# Altium project ESP32_CAN.PrjPcb
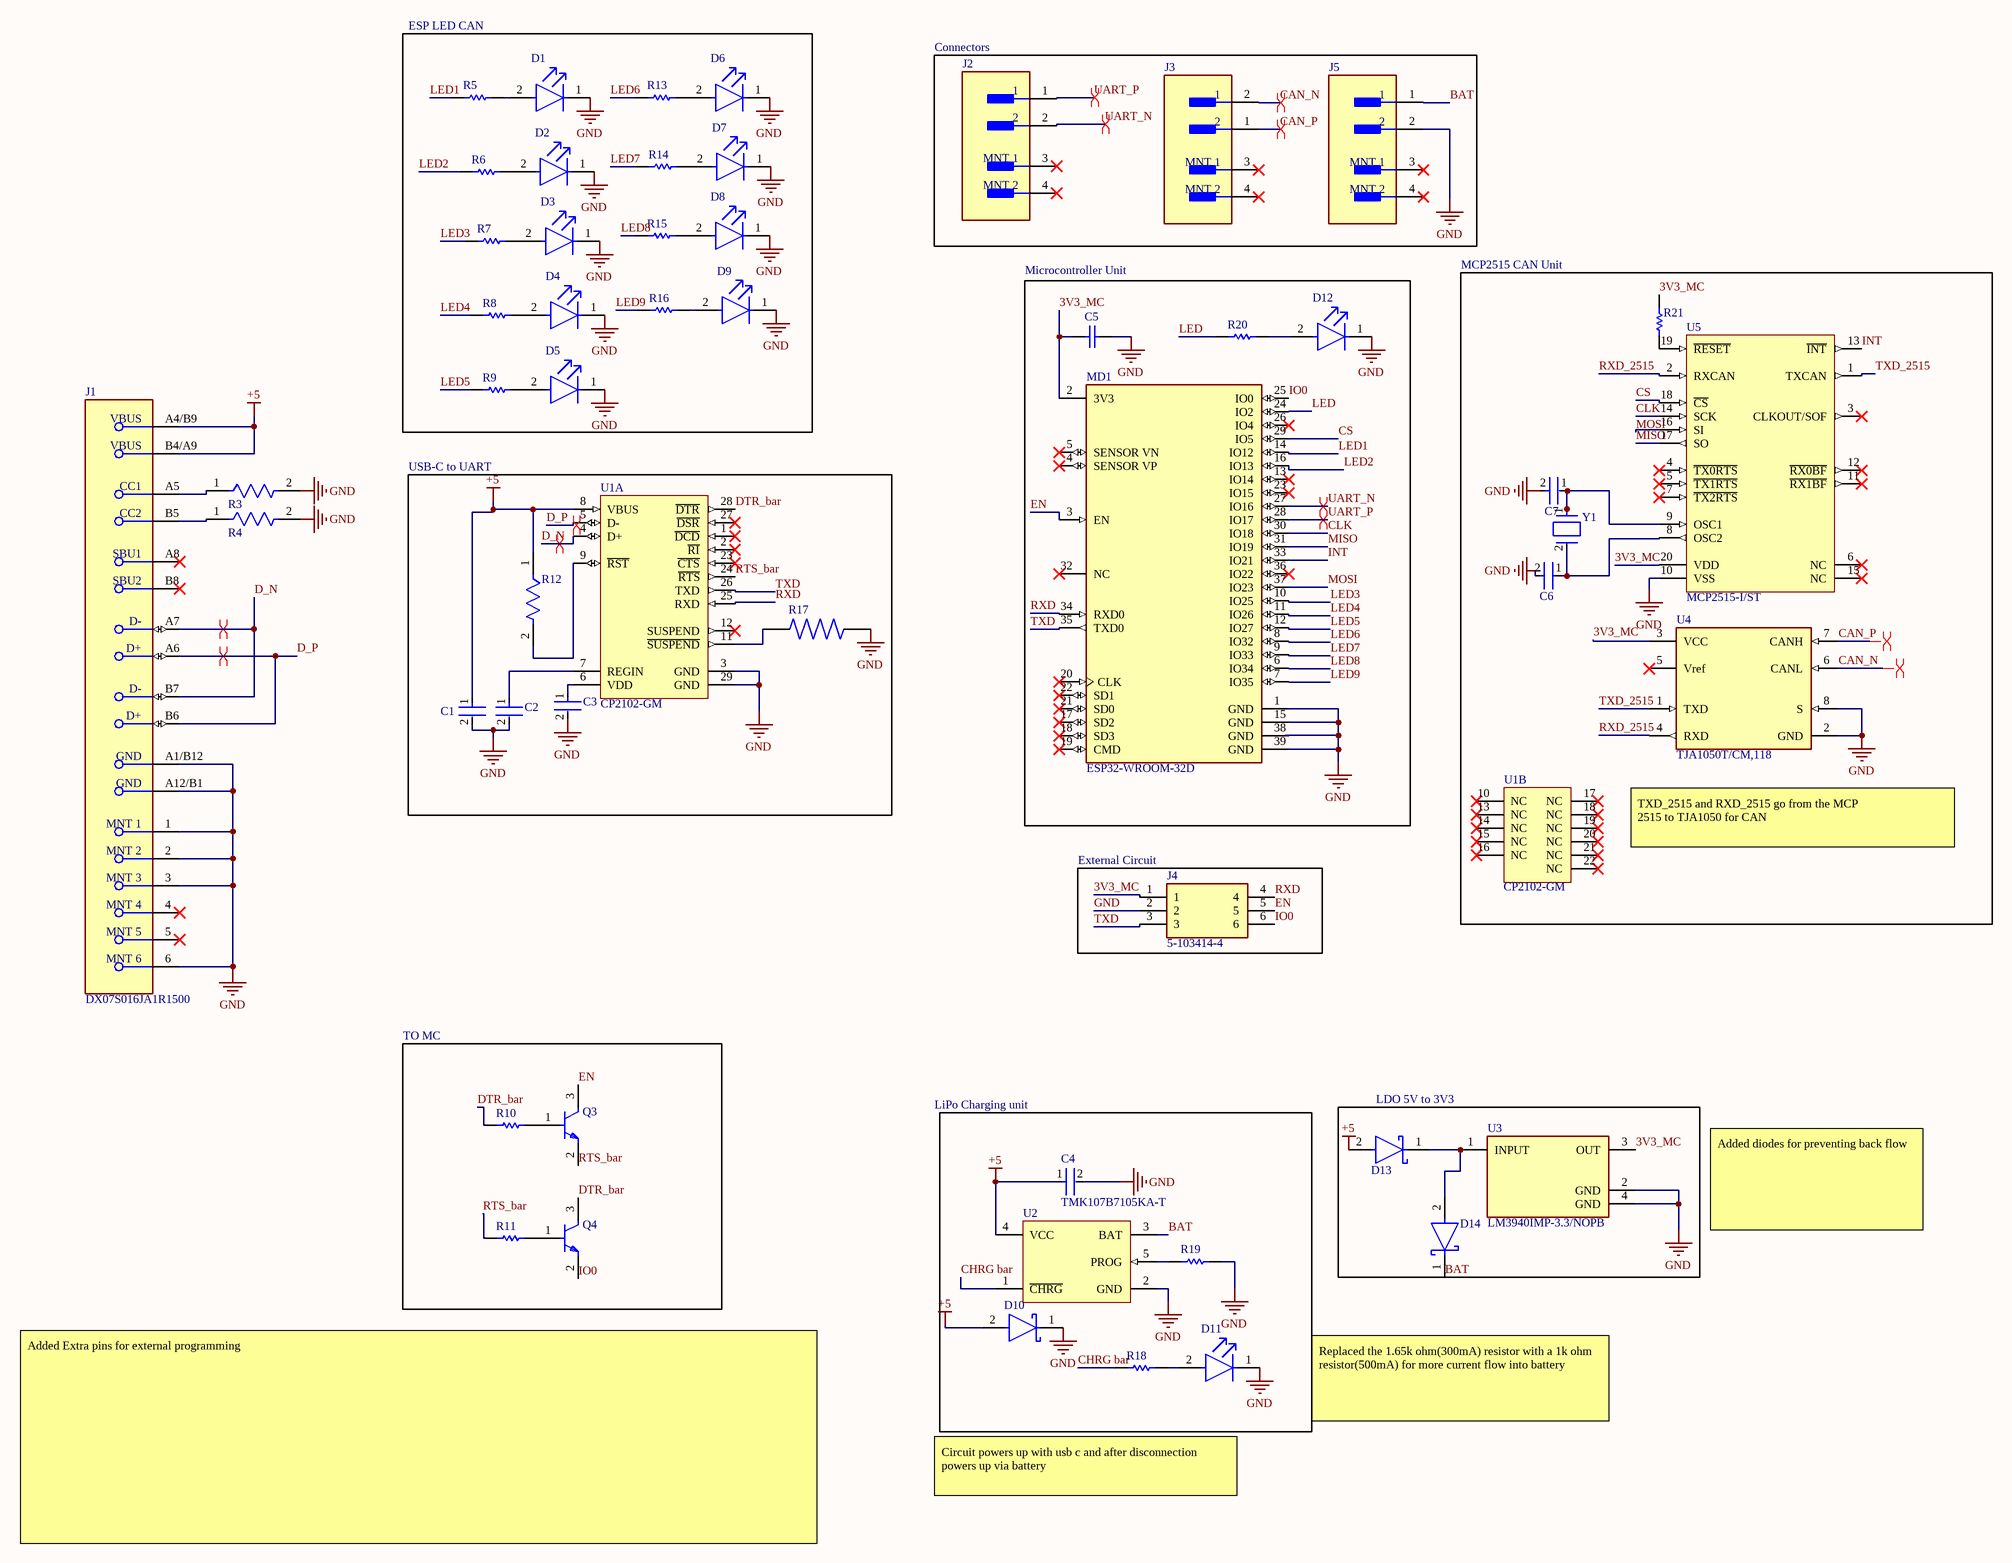
[diagram p0: ESP32_CAN.SchDoc]
1 sheet, 54 parts. Net scope: global (net labels, ports and power ports of the same name join across sheets).
Board file: ESP32_CAN.PcbDoc

## Sheet ESP32_CAN.SchDoc
size A2; SheetNumber: 1; SheetTotal: 1

### Parts
C1  TMK107B7105KA-T  [FP-0603-L_1_6_0_1-W_0_8_0-MFG]  (value not drawn)
C2  C0603C104K5RACTU  [FP-C0603C-CF-MFG]  (value not drawn)
C3  GRM033R60J104KE19D  [FP-GRM033-0_03-MFG]  (value not drawn)
C4  TMK107B7105KA-T  [FP-0603-L_1_6_0_1-W_0_8_0-MFG]
C5  GRM188R71H104KA93D  [CAPC1608X90X35ML10T15]  (value not drawn)
C6  C1608C0G1H220J080AA  [FP-C1608-080-0_1-MFG]  (value not drawn)
C7  C1608C0G1H220J080AA  [FP-C1608-080-0_1-MFG]  (value not drawn)
D1  LTST-C191TBKT  [FP-LTST-C191TBKT-MFG]  (value not drawn)
D2  LTST-C191TBKT  [FP-LTST-C191TBKT-MFG]  (value not drawn)
D3  LTST-C191TBKT  [FP-LTST-C191TBKT-MFG]  (value not drawn)
D4  LTST-C191TBKT  [FP-LTST-C191TBKT-MFG]  (value not drawn)
D5  LTST-C191TBKT  [FP-LTST-C191TBKT-MFG]  (value not drawn)
D6  LTST-C191TBKT  [FP-LTST-C191TBKT-MFG]  (value not drawn)
D7  LTST-C191TBKT  [FP-LTST-C191TBKT-MFG]  (value not drawn)
D8  LTST-C191TBKT  [FP-LTST-C191TBKT-MFG]  (value not drawn)
D9  LTST-C191TBKT  [FP-LTST-C191TBKT-MFG]  (value not drawn)
D10  DFLS1200Q-7  [FP-PowerDI123-MFG]  (value not drawn)
D11  LTST-C191TBKT  [FP-LTST-C191TBKT-MFG]  (value not drawn)
D12  LTST-C191TBKT  [FP-LTST-C191TBKT-MFG]  (value not drawn)
D13  1N5819HW-7-F  [FP-SOD123-MFG]  (value not drawn)
D14  1N5819HW-7-F  [FP-SOD123-MFG]  (value not drawn)
J1  DX07S016JA1R1500  [FP-DX07S016JA1R1500-MFG]
J2  BM02B-GHS-TBT(LF)(SN)(N)  [FP-BM02B-GHS-TBT_LF_SN-MFG]  (value not drawn)
J3  BM02B-GHS-TBT(LF)(SN)(N)  [FP-BM02B-GHS-TBT_LF_SN-MFG]  (value not drawn)
J4  5-103414-4  [TE_5-103414-4]
J5  BM02B-GHS-TBT(LF)(SN)(N)  [FP-BM02B-GHS-TBT_LF_SN-MFG]  (value not drawn)
MD1  ESP32-WROOM-32D  [FP-ESP32-WROOM-32D-MFG]
Q3  BC817-25,215  [FP-SOT23-MFG]  (value not drawn)
Q4  BC817-25,215  [FP-SOT23-MFG]  (value not drawn)
R3  ERJ-3EKF5101V  [FP-ERJ3EK-MFG]  (value not drawn)
R4  ERJ-3EKF5101V  [FP-ERJ3EK-MFG]  (value not drawn)
R5  ERJ-3EKF2200V  [RESC1608X55X30LL15T15]  (value not drawn)
R6  ERJ-3EKF2200V  [RESC1608X55X30LL15T15]  (value not drawn)
R7  ERJ-3EKF2200V  [RESC1608X55X30LL15T15]  (value not drawn)
R8  ERJ-3EKF2200V  [RESC1608X55X30LL15T15]  (value not drawn)
R9  ERJ-3EKF2200V  [RESC1608X55X30LL15T15]  (value not drawn)
R10  CRCW040210K0FKEDHP  [RESC1005X40X25ML05T10]  (value not drawn)
R11  CRCW040210K0FKEDHP  [RESC1005X40X25ML05T10]  (value not drawn)
R12  CRCW06034K70FKEA  [FP-CRCW0603-e3-MFG]  (value not drawn)
R13  ERJ-3EKF2200V  [RESC1608X55X30LL15T15]  (value not drawn)
R14  ERJ-3EKF2200V  [RESC1608X55X30LL15T15]  (value not drawn)
R15  ERJ-3EKF2200V  [RESC1608X55X30LL15T15]  (value not drawn)
R16  ERJ-3EKF2200V  [RESC1608X55X30LL15T15]  (value not drawn)
R17  CR0603AFX-1002EAS  [RESC1608X55N]  (value not drawn)
R18  ERJ-3EKF2200V  [RESC1608X55X30LL15T15]  (value not drawn)
R19  RK73H1JTTD1001F  [RESC1608X55X30LL20T10]  (value not drawn)
R20  ERJ-3EKF2200V  [RESC1608X55X30LL15T15]  (value not drawn)
R21  CRCW060310K0FKEA  [RESC1609X50X30NL8T20]  (value not drawn)
U1  CP2102-GM  [SLAB-QFN-28-3125x3125TP_M]  (parts A,B of 2)
U2  LTC4054ES5-4.2#TRMPBF  [LT-S5-5-TSOT-23_M]  (value not drawn)
U3  LM3940IMP-3.3/NOPB  [FP-DCY0004A-MFG]
U4  TJA1050T/CM,118  [FP-SOT96-1-IPC_A]
U5  MCP2515-I/ST  [TSSOP-ST20_N]
Y1  ABM3-8.000MHZ-D2Y-T  [FP-ABM3-MFG]  (value not drawn)

### Blocks framed on the sheet
ESP LED CAN: D1-D9 R5-R9 R13-R16
Connectors: J2 J3 J5
Microcontroller Unit: C5 D12 MD1 R20
MCP2515 CAN Unit: C6 C7 R21 U1 U4 U5 Y1
USB-C to UART: C1-C3 R12 R17 U1
External Circuit: J4
TO MC: Q3 Q4 R10 R11
LDO 5V to 3V3: D13 D14 U3

### Nets
+5: C1.1 C4.1 D10.2(A) D13.2(A) J1.A4/B9(VBUS) J1.B4/A9(VBUS) R12.1 U1.8(VBUS) U2.4(VCC)
GND: C1.2 C2.2 C3.2 C4.2 C5.2 C6.2 C7.2 D1.1(C) D2.1(C) D3.1(C) D4.1(C) D5.1(C) D6.1(C) D7.1(C) D8.1(C) D9.1(C) D10.1(C) D11.1(C) D12.1(C) J1.1(MNT_1) J1.2(MNT_2) J1.3(MNT_3) J1.6(MNT_6) J1.A1/B12(GND) J1.A12/B1(GND) J4.2 J5.2 MD1.1(GND) MD1.15(GND) MD1.39(GND) R3.2 R4.2 R17.2 R19.2 U1.3(GND) U1.29(GND) U2.2(GND) U3.2(GND) U3.4(GND) U4.2(GND) U4.8(S) U5.10(VSS)
3V3_MC: C5.1 J4.1 MD1.2(3V3) R21.2 U3.3(OUT) U4.3(VCC) U5.20(VDD)
BAT: D14.1(C) J5.1 U2.3(BAT)
CAN_N: J3.2 U4.6(CANL)
CAN_P: J3.1 U4.7(CANH)
CHRG bar: R18.1 U2.1(~{CHRG})
CLK: MD1.30(IO18) U5.14(SCK)
CS: MD1.29(IO5) U5.18(~{CS})
D_N: J1.A7(D-) J1.B7(D-) U1.4(D+)
D_P: J1.A6(D+) J1.B6(D+) U1.5(D-)
DTR_bar: Q4.3(C) R10.1 U1.28(~{DTR})
EN: J4.5 MD1.3(EN) Q3.3(C)
INT: MD1.33(IO21) U5.13(~{INT})
IO0: J4.6 MD1.25(IO0) Q4.2(E)
LED: MD1.24(IO2) R20.1
LED1: MD1.14(IO12) R5.1
LED2: MD1.16(IO13) R6.1
LED3: MD1.10(IO25) R7.1
LED4: MD1.11(IO26) R8.1
LED5: MD1.12(IO27) R9.1
LED6: MD1.8(IO32) R13.1
LED7: MD1.9(IO33) R14.1
LED8: MD1.6(IO34) R15.1
LED9: MD1.7(IO35) R16.1
MISO: MD1.31(IO19) U5.17(SO)
MOSI: MD1.37(IO23) U5.16(SI)
RTS_bar: Q3.2(E) R11.1 U1.24(~{RTS})
RXD: J4.4 MD1.34(RXD0) U1.25(RXD)
RXD_2515: U4.4(RXD) U5.2(RXCAN)
TXD: J4.3 MD1.35(TXD0) U1.26(TXD)
TXD_2515: U4.1(TXD) U5.1(TXCAN)
UART_N: J2.2 MD1.27(IO16)
UART_P: J2.1 MD1.28(IO17)
NetC2_1: C2.1 U1.7(REGIN)
NetC3_1: C3.1 U1.6(VDD)
NetC6_1: C6.1 U5.8(OSC2) Y1.2
NetC7_1: C7.1 U5.9(OSC1) Y1.1
NetD1_2: D1.2(A) R5.2
NetD2_2: D2.2(A) R6.2
NetD3_2: D3.2(A) R7.2
NetD4_2: D4.2(A) R8.2
NetD5_2: D5.2(A) R9.2
NetD6_2: D6.2(A) R13.2
NetD7_2: D7.2(A) R14.2
NetD8_2: D8.2(A) R15.2
NetD9_2: D9.2(A) R16.2
NetD11_2: D11.2(A) R18.2
NetD12_2: D12.2(A) R20.2
NetD13_1: D13.1(C) D14.2(A) U3.1(INPUT)
NetJ1_A5: J1.A5(CC1) R3.1
NetJ1_B5: J1.B5(CC2) R4.1
NetQ3_1: Q3.1(B) R10.2
NetQ4_1: Q4.1(B) R11.2
NetR12_2: R12.2 U1.9(~{RST})
NetR17_1: R17.1 U1.11(~{SUSPEND})
NetR19_1: R19.1 U2.5(PROG)
NetR21_1: R21.1 U5.19(~{RESET})

Not connected (* = marked no-connect by the designer): J1 4(MNT_4)* 5(MNT_5)* A8(SBU1)* B8(SBU2)*; J2 3(MNT_1)* 4(MNT_2)*; J3 3(MNT_1)* 4(MNT_2)*; J5 3(MNT_1)* 4(MNT_2)*; MD1 4(SENSOR_VP)* 5(SENSOR_VN)* 13(IO14)* 17(SD2)* 18(SD3)* 19(CMD)* 20(CLK)* 21(SD0)* 22(SD1)* 23(IO15)* 26(IO4)* 32(NC)* 36(IO22)* 38(GND); U1 1(~{DCD})* 2(~{RI})* 10(NC)* 12(SUSPEND)* 13(NC)* 14(NC)* 15(NC)* 16(NC)* 17(NC)* 18(NC)* 19(NC)* 20(NC)* 21(NC)* 22(NC)* 23(~{CTS})* 27(~{DSR})*; U4 5(Vref); U5 3(CLKOUT/SOF)* 4(~{TX0RTS})* 5(~{TX1RTS})* 6(NC)* 7(~{TX2RTS})* 11(~{RX1BF})* 12(~{RX0BF})* 15(NC)*

### Layout directives
differential pair: CAN_N, CAN_P, D_N, D_P, UART_N, UART_P

### Notes on the sheet
- TXD_2515 and RXD_2515 go from the MCP
  2515 to TJA1050 for CAN
- LiPo Charging unit
- Added diodes for preventing back flow
- Replaced the 1.65k ohm(300mA) resistor with a 1k ohm resistor(500mA) for more current flow into battery
- Circuit powers up with usb c and after disconnection powers up via battery
- Added Extra pins for external programming

### Library data of the parts
C1 C4 = CMP-2000-07259-3: None; Voltage Rating (DC): 25V; Dielectric: X7R; Capacitance: 1uF; Tolerance: 10%; Height: 0.8mm; Case Code (Metric): 1608; Max Operating Temperature: 125°C; Case Code (Imperial): 0603; Case/Package: 0603; Resistor Type: Ceramic; Halogen Free: Halogen Free; Series: M; Voltage Rating: 25V; Number of Pins: 2; Depth: 0.8mm; RoHS Compliant: Yes; Mount: Surface Mount; Min Operating Temperature: -55°C; Length: 1.6mm; Contact Plating: Tin; Radiation Hardening: No; Width: 0.031inch; Construction: Flat; Thickness: 0.035inch; Packaging: Tape and Reel; Termination: SMD/SMT; REACH SVHC: No SVHC; Package Quantity: 1
C2 = CMP-2006-03061-2: CAP CER 0.1UF 50V X7R 0603; Manufacturer: KEMET; Tolerance: 0.1; Temperature Coefficient: 30ppm/°C; Material: Ceramic; Automotive Grade: Grade 1; Value: 0.10 μF; Temperature: -55°C to +125°C; RoHS: TRUE; Temperature Range High: +125°C; Lead Free: Yes; Octopart: https://octopart.com/c0603c104k5ractu-kemet-139244; Digikey Description: CAP CER 0.1UF 50V X7R 0603; Category: Cap; Package: C0603C-CF; ComponentLink2Description: Datasheet; Temperature Range Low: -55°C; Device Class L1: Passive Components; Voltage Rating: 50 V; Automotive: Yes; Device Class L3: Ceramic Capacitors; ComponentLink2URL: https://api.kemet.com/component-edge/download/datasheet/C0603C100J5GACAUTO.pdf; Capacitance: 0.10 μF; Device Class L2: Capacitors; Manufacturer Part Number: C0603C104K5RACTU; Temperature Characteristic: X7R; Height: 0.87mm
C3 = CMP-06035-000062-2: Chip Multilayer Ceramic Capacitors for General Purpose, 0201, 0.10uF, X5R, 15%, 10%, 6.3V; Capacitance: 100nF; Min Operating Temperature: -55°C; Lead Free: Lead Free; Radiation Hardening: No; Dielectric: X5R; Voltage Rating (DC): 6.3V; REACH SVHC: No SVHC; Case/Package: 0201; Voltage Rating: 6.3V; Length: 0.6mm; Max Operating Temperature: 85°C; Width: 0.012inch; Depth: 0.3mm; Material: Ceramic; Case Code (Metric): 0603; Thickness: 0.013inch; Packaging: Tape and Reel; Height: 0.3mm; Weight: 6E-06oz; Package Quantity: 1; Mount: Surface Mount; Voltage: 6.3V; Case Code (Imperial): 0201; Tolerance: 10%; Termination: SMD/SMT
C5 = CMP-2100-03643-1: Chip Capacitor, 0.1 uF, +/- 10%, 50 V, -55 to 125 degC, 0603 (1608 Metric), RoHS, Tape and Reel; Manufacturer: Murata; Dielectric Material: Ceramic; Voltage Rating: 50V; Capacitance: 100nF; Dielectric: X7R; Insulation Resistance: 10GR; Case Code (Metric): 1608; Lead Free: LeadFree; Depth: 0.8mm; Number of Pins: 2; Radiation Hardening: No; Case/Package: 0603; Manufacturer URL: http://www.murata.com/; Packaging: TapeandReel; Length: 1.6mm; Contact Plating: Tin; Datasheet URL: http://psearch.en.murata.com/capacitor/product/GRM188R71H104KA93%23.pdf; Tolerance: 10%; Case Code (Imperial): 0603; Min Operating Temperature: -55degC; RoHSCompliant: true; Voltage: 50V; Termination: SMD/SMT; Mount: SurfaceMount; Material: Ceramic; Package Quantity: 1; Height: 0.8mm; Thickness: 0.035inch; REACH SVHC: NoSVHC; Max Operating Temperature: 125degC; Width: 0.8mm; Package Reference: 0603; Voltage Rating (DC): 50V; Datasheet Version: 42675.0; Package Description: 2-Pin Surface Mount Device, Body 1.6 x 0.8 mm
C6 C7 = CMP-2000-06024-2: CAP CER 22PF 50V C0G 0603; Tolerance: 5%; Temperature Coefficient: 30ppm/°C; Dielectric Material: Ceramic; Packaging: Tape and Reel; Termination: SMD/SMT; Case Code (Imperial): 0603; Height: 0.8mm; Capacitance: 22pF; Voltage: 50V; RoHS Compliant: Yes; Voltage Rating: 50V; Depth: 0.8mm; Case Code (Metric): 1608; Voltage Rating (DC): 50V; Construction: Flat; Max Operating Temperature: 125°C; Radiation Hardening: No; Lead Free: Lead Free; Number of Pins: 2; Case/Package: 0603; Thickness: 0.037inch; Min Operating Temperature: -55°C; Width: 0.031inch; Mount: Surface Mount; Weight: 7.1E-05oz; Series: C; Dielectric: C0G; Package Quantity: 1; Length: 1.6mm
D1-D9 D11 D12 = CMP-22017-000008-1: LED BLUE CLEAR CHIP SMD; Lens Color: Colorless; Dominant Wavelength: 475nm; Forward Current: 20mA; Wavelength: 468nm; Viewing Angle: 130°; Power Dissipation: 76mW; Luminous Intensity: 180mcd; Reverse Voltage: 5V; Number of Elements: 1; Lens Style: Diffused; Forward Voltage: 3.8V; Max Power Dissipation: 75mW; Case Code (Metric): 1608; Packaging: Tape and Reel; Case/Package: 0603; Depth: 1.6mm; Mount: Surface Mount; Lead Free: Lead Free; Min Operating Temperature: -20°C; Lens Transparency: Clear; Illumination Color: Blue; Height: 0.55mm; Test Current: 20mA; Case Code (Imperial): 0603; Max Operating Temperature: 80°C; Number of Pins: 2; Length: 0.8mm; Radiation Hardening: No; Package Quantity: 1; Number of LEDs: 1; Width: 0.8mm; Color: Blue
D10 = CMP-12790-000008-1: DIODE SCHOTTKY 200V POWERDI123; Manufacturer: Diodes; Max Surge Forward Current: 40A; Max Junction Temp: +150°C; Forward Current: 1A; Automotive Grade: Grade 0; Peak Reverse Current: 2uA; Value: 23pF; Max Repetitive Reverse Voltage: 200V; ComponentLink2Description: Datasheet; Mouser Description: DFLS1200Q Series 200 V 1 A High Voltage Schottky Barrier Rectifier - POWERDI®123; RoHS: TRUE; Octopart: https://octopart.com/dfls1200q-7-diodes+inc.-46962012; Temperature Range Low: -55°C; Category: Diode; ComponentLink2URL: https://www.diodes.com/assets/Datasheets/DFLS1200Q.pdf; Reverse Voltage: 200V; Temperature Range High: +150°C; Manufacturer Part Number: DFLS1200Q-7; Footprint Url: https://www.diodes.com/assets/Package-Files/PowerDI123.pdf; Automotive: Yes; Height: 1mm; Capacitance: 23pF; Device Class L1: Discrete Semiconductors; Digikey Description: DIODE SCHOTTKY 200V POWERDI123; Lead Free: Yes; Temperature: -55°C to +150°C; Device Class L2: Diodes; Device Class L3: Schottky Diodes; Package: PowerDI123
D13 D14 = CMP-0303-00003-3: DIODE SCHOTTKY 40V 1A SOD123; Forward Voltage: 450mV; Capacitance: 110pF; Max Forward Surge Current (Ifsm): 25A; Peak Reverse Current: 50uA; Polarity: Standard; Element Configuration: Single; Max Power Dissipation: 450mW; Min Operating Temperature: -65°C; Package Quantity: 3000; Contact Plating: Tin; Weight: 0.000353oz; Max Repetitive Reverse Voltage (Vrrm): 40V; Max Reverse Voltage (DC): 40V; Height: 1.25mm; Average Rectified Current: 1A; Width: 1.7mm; Case/Package: SOD-123-2; Lead Free: Lead Free; Max Operating Temperature: 125°C; Current Rating: 1A; Termination: SMD/SMT; Forward Current: 1A; Radiation Hardening: No; Number of Pins: 2; Length: 2.85mm; Voltage Rating (DC): 40V; REACH SVHC: No SVHC; Peak Non-Repetitive Surge Current: 25A; Packaging: Tape and Reel; Output Current: 1A
J1 = CMP-00000-1: USB Connector, 16 Contact(s), Female, Right Angle, Surface Mount Terminal, Locking, Receptacle; Shielding: Shielded; Current Rating: 5A; Number of Ports: 1; Mating Cycles: 10000; USB Standard: USB 2.0; Voltage Rating: 20V; Number of Contacts: 16; Contact Plating: Gold; Termination: Solder; Gender: Receptacle; Series: DX07; Max Operating Temperature: 85°C; Insulation Color: Black; Height: 3.31mm; Min Operating Temperature: -40°C; Connector Type: USB; Mounting Technology: Surface Mount,Through Hole,Horizontal; Contact Material: Nickel,Gold
J2 J3 J5 = CMP-2000-05957-2: CONN HEADER SMD 2POS 1.25MM; Pitch: 0.049inch; Connector Type: Outer Shroud Contact; Number of Positions: 2; Packaging: Tape and Reel; Lead Free: Lead Free; Termination: Solder; Fastening Type: Ramp; Number of Rows: 1; Color: Natural; Contact Plating: Tin; Mount: Surface Mount
J4 = 5-103414-4: 06 MODII HDR SRST SHRD LF; MF: {'manufacturer': u'TE Connectivity'}; Package: None; Price: None; Value: *; MP: 5-103414-4; Availability: Unavailable
MD1 = CMP-194065-000003-1: WIFI MODULE 32MBITS SPI FLASH; Manufacturer: Espressif Systems; Max Supply Voltage: 3.6V; Nominal Supply Current: 500mA; Max Frequency: 2484MHz; Number Of Adc Channels: 16; Number Of Gpio: 32; Interface: I2C,SPI,UART,Ethernet,I2S,Other; Data Rate: 150Mbits/s; Min Supply Voltage: 3V; Bandwidth: 72MHz; Sensitivity: -98dBm; Octopart: https://octopart.com/esp32-wroom-32d-espressif+systems-91040050; Package: ESP32-WROOM-32D; ComponentLink2URL: https://www.espressif.com/sites/default/files/documentation/esp32-wroom-32d_esp32-wroom-32u_datasheet_en.pdf; Lead Free: Yes; Category: UNK; Mouser Description: Wi-Fi/BT BLE Module ESP32-D0WD, SPI Flash, UART, P; Device Class L1: Integrated Circuits (ICs); RoHS: TRUE; Temperature Range Low: -40°C; ComponentLink2Description: Datasheet; Digikey Description: WIFI MODULE 32MBITS SPI FLASH; Height: 3.2mm; Temperature: -40°C to +85°C; Manufacturer Part Number: ESP32-WROOM-32D; Device Class L3: Transceivers; Device Class L2: RF Semiconductors and Devices; Temperature Range High: +85°C; Automotive: No
Q3 Q4 = CMP-14406-000029-1: TRANS NPN 45V 500MA TO236AB; RoHS Compliant: Yes
R3 R4 = CMP-2000-00540-8: RES SMD 5.1K OHM 1% 1/10W 0603; Power Rating: 100mW; Temperature Coefficient: 100ppm/°C; Voltage Rating: 75V; Resistance: 5.1kR; Military Standard: Not; Case/Package: 0603; Packaging: Tape and Reel; Package Quantity: 1; Reach SVHC Compliant: Yes; Lead Free: Lead Free; Mount: Surface Mount; Size Code: 0603; Depth: 0.8mm; Resistance Tolerance: 1%; Number of Terminations: 2; Resistor Type: Thick Film; Width: 0.8mm; Construction: Rectangular; Series: ERJ; Radiation Hardening: No; Max Operating Temperature: 155°C; Features: Automotive AEC-Q200; Tolerance: 1%; Voltage Rating (DC): 75V; Length: 1.6mm; RoHS Compliant: Yes; Min Operating Temperature: -55°C; Case Code (Metric): 1608; Termination: SMD/SMT; Weight: 7.1E-05oz; Max Power Dissipation: 100mW; Contact Plating: Tin; Height: 0.022inch; Case Code (Imperial): 0603
R5-R9 R13-R16 R18 R20 = CMP-2000-00335-2: Chip Resistor, 220 Ohm, +/- 1%, 0.1 W, -55 to 155 degC, 0603 (1608 Metric), RoHS, Tape and Reel; Voltage Rating: 50 V; Resistance: 22 Ohm; Power Rating: 100 mW; Case\Package: 0603; ComponentLink2Description: Datasheet; PackageDescription: 2-Pin Surface Mount Device, Body 1.6 x 0.85 mm; PackageReference: 0603; ComponentLink1Description: Manufacturer URL; ComponentLink2URL: http://industrial.panasonic.com/cdbs/www-data/pdf/RDA0000/AOA0000C86.pdf; Height: 0.45 mm; Mount: Surface Mount; Case Code (Metric): 1608; Pins: 2; Width: 0.8 mm; Length: 1.6 mm; Package Quantity: 5000; Tolerance: 1%; ComponentLink1URL: http://www.panasonic.com/; Max Operating Temperature: 155 degC; Min Operating Temperature: -55 degC; RoHSCompliant: true; Packaging: Tape and Reel; Case Code (Imperial): 0603; DatasheetVersion: Apr-15; REACH SVHC: No SVHC; Voltage Rating (DC): 50 V
R10 R11 = CMP-2002-03043-1: Manufacturer: Vishay Dale; Part Number: CRCW040210K0FKEDHP
R12 = CMP-1666-00019-3: RES Thick Film, 4.7kΩ, 1%, 0.1W, 100ppm/°C, 0603; Resistance: 4.7kR; Voltage Rating: 75V; Power Rating: 100mW; Case Code (Metric): 1608; Military Standard: Not; Packaging: Tape and Reel; Termination: SMD/SMT; Temperature Coefficient: 100ppm/°C; Lead Free: Lead Free; Length: 1.55mm; Width: 0.85mm; Height: 0.45mm; Depth: 0.85mm; Weight: 7.1E-05oz; Case Code (Imperial): 0603; Contact Plating: Tin; Case/Package: 0603; Max Operating Temperature: 155°C; Mount: Surface Mount; Tolerance: 1%; Min Operating Temperature: -55°C; Package Quantity: 5000; Voltage Rating (DC): 75V; Composition: Thick Film
R17 = CR0603AFX-1002EAS: MF: {'manufacturer': u'Bourns'}; Package: None; Price: None; Value: *; MP: CR0603AFX-1002EAS; Availability: Unavailable
R19 = CMP-2000-01098-1: Manufacturer: KOA Speer; Part Number: RK73H1JTTD1001F
R21 = CMP-1666-00005-4: Chip Resistor, 10 KOhm, +/- 1%, 100 mW, -55 to 155 degC, 0603 (1608 Metric), RoHS, Tape and Reel; Manufacturer: Vishay Semiconductor; Voltage Rating: 75 V; Max Operating Temperature: 155 degC; PackageDescription: 2-Pin Surface Mount Device, Body 1.575 x 0.85 mm; ComponentLink1Description: Manufacturer URL; RoHSCompliant: true; PackageReference: 0603; REACH SVHC: Unknown; Length: 1.55 mm; DatasheetVersion: 06/2012; Packaging: Tape and Reel; Min Operating Temperature: -55 degC; Mounting Technology: Surface Mount; ComponentLink2URL: https://datasheet.ciiva.com/11809/0900766b80d98afc-11809037.pdf; Height: 0.45 mm; ComponentLink2Description: Datasheet; Package Quantity: 5000; ComponentLink1URL: http://www.vishay.com/
U1 = CMP-0511-00012-1: Single-Chip USB to UART Bridge, 1024 Bytes EEPROM, -40 to 85 degC, 28-pin QFN, Tube; Manufacturer: Silicon Labs; Internal Oscillator: TRUE; Sub-Family: USB Bridges; ComponentLink3Description: Package Specification; PackageDescription: 28-Pin Quad-Flat No-Leads Package, Body 5 x 5 mm, Pitch 0.5 mm; PartNumber: CP2102-GM; EEPROM: 1024 Bytes; Mounting Technology: Surface Mount; ComponentLink2URL: http://www.silabs.com/Support%20Documents/TechnicalDocs/CP2102-9.pdf; DatasheetVersion: Rev. 1.5; ComponentLink1URL: http://www.silabs.com/; ComponentLink2Description: Datasheet; Code_JEDEC: MO-220; PackageReference: QFN-28; Code_IPC: J-STD-020C; ComponentLink3URL: http://www.silabs.com/Support%20Documents/TechnicalDocs/C8051T61x.pdf; ComponentLink1Description: Manufacturer URL
U2 = CMP-0471-00454-1: Standalone Linear Li-Ion Battery Charger with Thermal Regulation, 4.25 to 6.5 V Vin, 5-pin SOT23 (S5-5), -40 to 85 degC, Pb-Free, Mini Tape and Reel; Manufacturer: Linear Technology; Number of Cells: 1; Float Voltage: 4.2 V; Max Charge Current(A): 0.8; Vin Max(V): 6.5; Battery Chemistry: Li-Ion, Li-Polymer; Charge Termination: C/10; Vin Min(V): 4.25; ComponentLink1Description: Manufacturer URL; PackageReference: S5-5; ComponentLink1URL: http://www.linear.com/; ComponentLink3Description: Package Specification; Mounting Technology: Surface Mount; ComponentLink2URL: http://cds.linear.com/docs/en/datasheet/405442xf.pdf; Code_JEDEC: MO-193; Packing: Mini Tape and Reel; PartNumber: LTC4054ES5-4.2#TRMPBF; RoHS: TRUE; PackageDescription: 5-Pin Plastic TSOT-23, Body 1.63 x 2.90 mm, Pitch 0.95 mm; Type of Charger: Linear; PackageVersion: Jun-10; ComponentLink3URL: http://cds.linear.com/docs/en/packaging/SOT_5_05-08-1635.pdf; ComponentLink2Description: Datasheet
U3 = CMP-0062-01788-4: IC REG LINEAR 3.3V 1A SOT223-4; Min Input Voltage: 4.5V; Max Supply Voltage: 7.5V; Number of Outputs: 1; Output Type: Fixed; Polarity: Positive; Dropout Voltage: 500mV; Quiescent Current: 15mA; Max Output Voltage: 3.3V; Length: 6.5mm; Termination: SMD/SMT; Width: 3.56mm; Min Supply Voltage: 4.5V; Max Output Current: 1A; Case/Package: SOT-223; Output Voltage: 3.3V; Current Rating: 1A; Packaging: Tape and Reel; Lead Free: Lead Free; Nominal Output Voltage: 3.3V; Height: 1.6mm; Series: -; Output Configuration: Positive; Radiation Hardening: No; Number of Regulators: 1; Package Quantity: 1000; REACH SVHC: No SVHC; Max Input Voltage: 7.5V; Max Operating Temperature: 125°C; Min Operating Temperature: -40°C; Output Current: 1A; Contact Plating: Tin; Number of Pins: 4; Mount: Surface Mount
U4 = CMP-2000-04923-2: IC TRANSCEIVER HALF 1/1 8SO; Simplex/Duplex: Half Duplex; Max Supply Current: 10mA; Number of Receive Buffers: 1; Min Supply Voltage: 4.75V; Max Supply Voltage: 5.25V; Interface: CAN; Data Rate: 1Mbps; Receiver Hysteresis: 70mV; Number of Transmit Buffers: 1; Min Operating Temperature: -40°C; Case/Package: SO; REACH SVHC: No SVHC; Max Operating Temperature: 150°C; Number of Pins: 8; Lead Free: Lead Free; Number of Transceivers: 1; Packaging: Tape and Reel; Mount: Surface Mount; Radiation Hardening: No; Nominal Supply Current: 10mA; Package Quantity: 2500; Contact Plating: Gold
U5 = CMP-0186-00077-2: Stand-Alone CAN Controller With SPI Interface, 20-Pin TSSOP, Industrial Temperature; DatasheetVersion: revF, Oct-2010; ComponentLink1Description: Manufacturer URL; PackageDescription: 20-Lead Plastic Thin Shrink Small Outline (ST) - 4.4mm Body [TSSOP]; ComponentLink1URL: http://www.microchip.com/; RevisionNote: URLs added. DatasheetVersion updated.; PackageReference: TSSOP-ST20; Code_JEDEC: MO-153-AC; ComponentLink2Description: Datasheet; ComponentLink2URL: http://ww1.microchip.com/downloads/en/DeviceDoc/21801f.pdf; PackageVersion: revBB, Aug-2009; ComponentLink3URL: http://www.microchip.com/stellent/groups/techpub_sg/documents/packagingspec/en012702.pdf; ComponentLink3Description: Package Specification
Y1 = CMP-2000-05033-2: Crystal 8MHz ±20ppm 18pF SMD-2 5mm x 3.2mm; Series Resistance: 500R; Frequency Stability: 30ppm; ESR (Equivalent Series Resistance): 140R; Load Capacitance: 18pF; Height: 0.051inch; Tolerance: 20ppm; Depth: 3.2mm; Max Operating Temperature: 85°C; Frequency: 8MHz; Termination: SMD/SMT; Lead Free: Lead Free; Number of Pins: 2; Width: 3.2mm; RoHS Compliant: Yes; Resistor Type: Ceramic; Length: 5mm; Mount: Surface Mount; Case/Package: CSMD; Package Quantity: 1000; Radiation Hardening: No; Min Operating Temperature: -40°C; Packaging: Tape and Reel; Frequency Tolerance: 20ppm